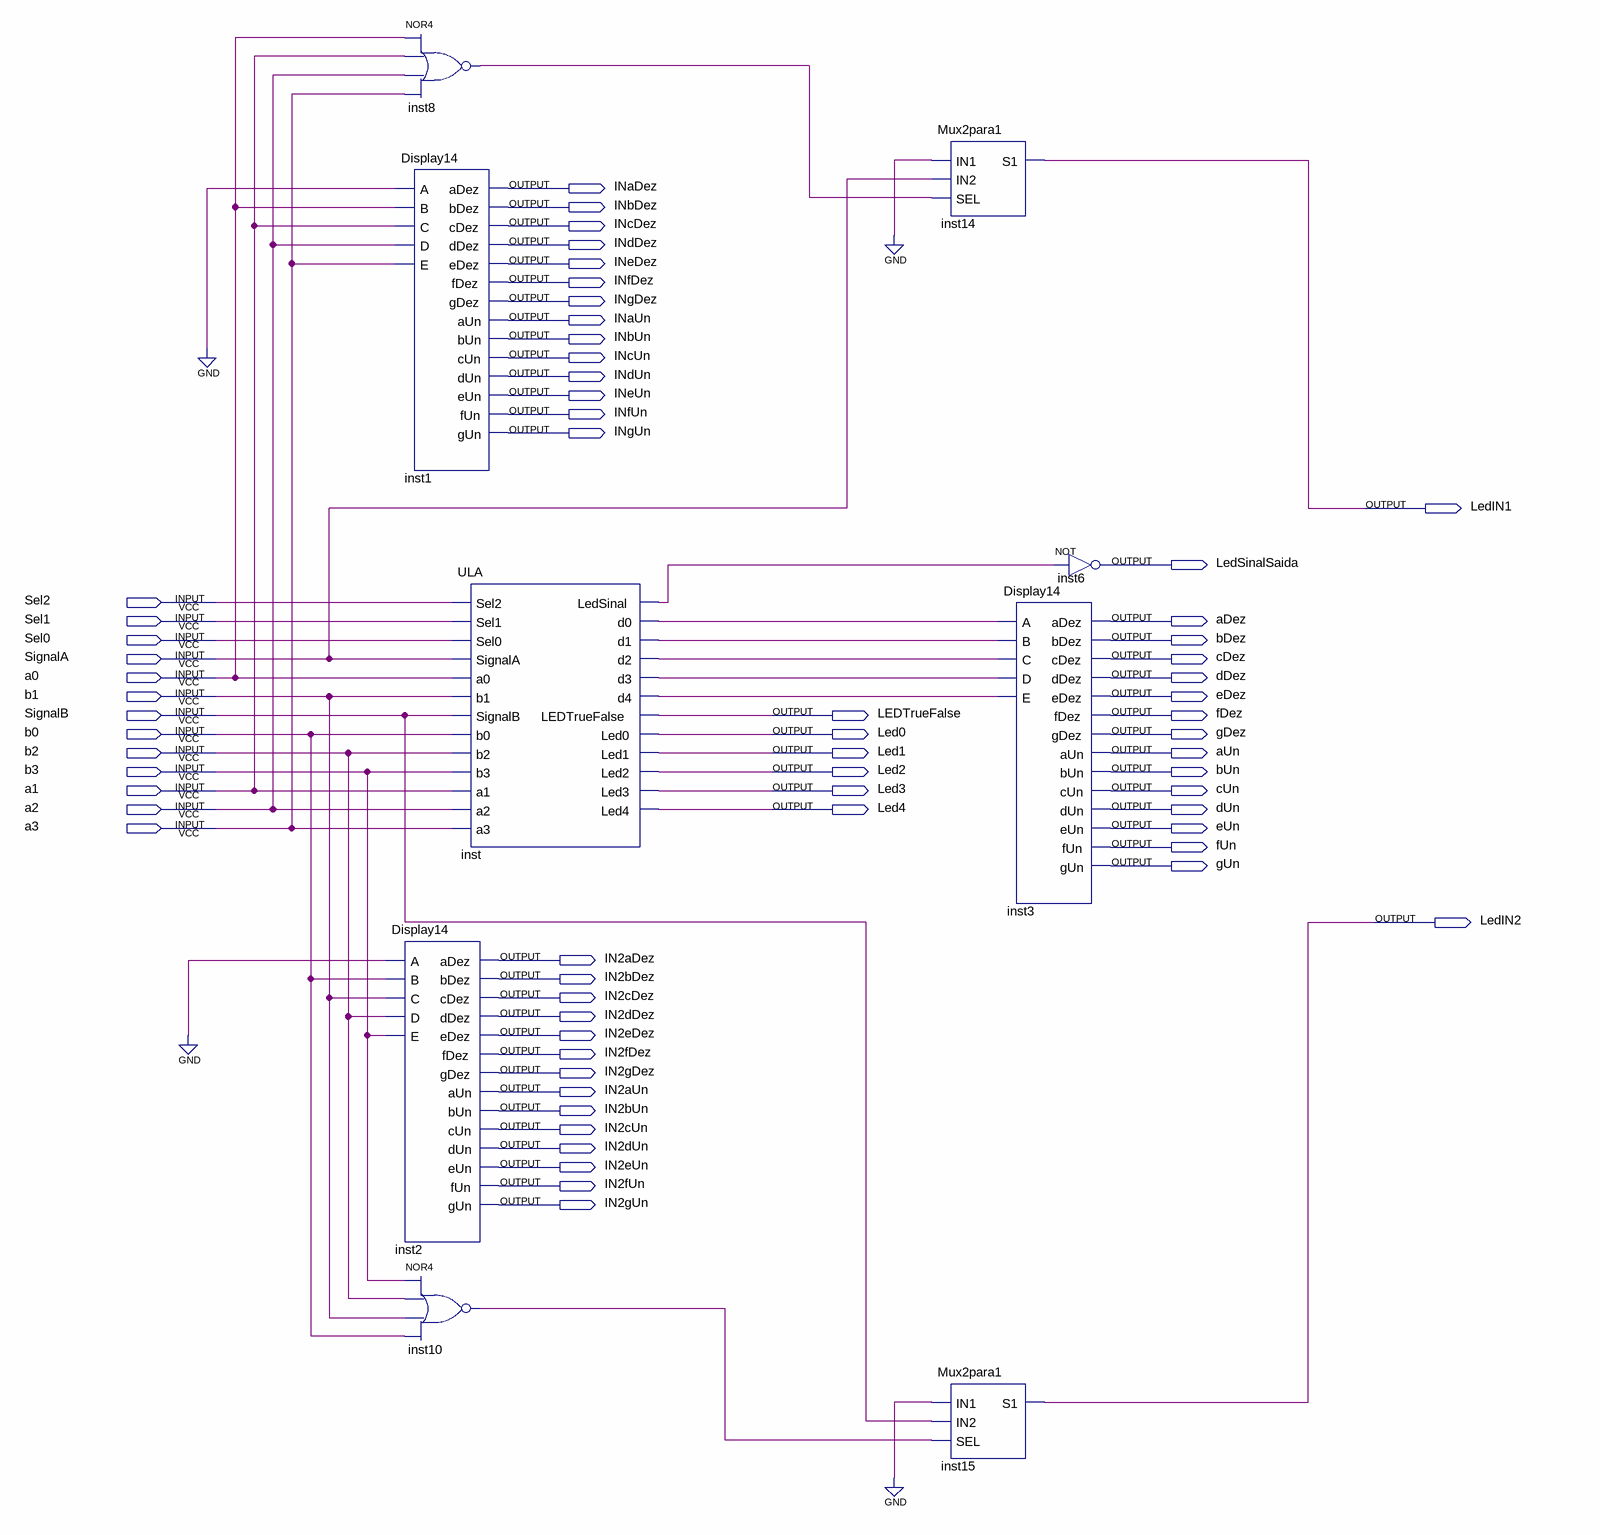
[diagram p0: schematic sheet]
// Quartus schematic FinalULAULA.bdf as structural Verilog: 9 symbols, 64 pins
module FinalULAULA (
  input  Sel2,
  input  Sel1,
  input  Sel0,
  input  SignalA,
  input  a0,
  input  b1,
  input  SignalB,
  input  b0,
  input  b2,
  input  b3,
  input  a1,
  input  a2,
  input  a3,
  output INaDez,
  output INbDez,
  output INcDez,
  output INdDez,
  output INeDez,
  output INfDez,
  output INgDez,
  output INaUn,
  output INbUn,
  output INcUn,
  output INdUn,
  output INeUn,
  output INfUn,
  output INgUn,
  output LedIN1,
  output LedSinalSaida,
  output aDez,
  output bDez,
  output cDez,
  output dDez,
  output eDez,
  output LEDTrueFalse,
  output fDez,
  output Led0,
  output gDez,
  output Led1,
  output aUn,
  output Led2,
  output bUn,
  output Led3,
  output cUn,
  output Led4,
  output dUn,
  output eUn,
  output fUn,
  output gUn,
  output LedIN2,
  output IN2aDez,
  output IN2bDez,
  output IN2cDez,
  output IN2dDez,
  output IN2eDez,
  output IN2fDez,
  output IN2gDez,
  output IN2aUn,
  output IN2bUn,
  output IN2cUn,
  output IN2dUn,
  output IN2eUn,
  output IN2fUn,
  output IN2gUn
);

  wire inst8_out, inst10_out, inst_d0, inst_d1, inst_d2, inst_d3, inst_d4, inst_ledsinal;

  nor inst8 (inst8_out, a0, a1, a2, a3);
  Display14 inst1 (
    .A(1'b0), .B(a0), .C(a1), .D(a2), .E(a3), .aDez(INaDez), .bDez(INbDez), .cDez(INcDez), .dDez(INdDez),
    .eDez(INeDez), .fDez(INfDez), .gDez(INgDez), .aUn(INaUn), .bUn(INbUn), .cUn(INcUn), .dUn(INdUn),
    .eUn(INeUn), .fUn(INfUn), .gUn(INgUn));
  Display14 inst2 (
    .A(1'b0), .B(b0), .C(b1), .D(b2), .E(b3), .aDez(IN2aDez), .bDez(IN2bDez), .cDez(IN2cDez), .dDez(IN2dDez),
    .eDez(IN2eDez), .fDez(IN2fDez), .gDez(IN2gDez), .aUn(IN2aUn), .bUn(IN2bUn), .cUn(IN2cUn), .dUn(IN2dUn),
    .eUn(IN2eUn), .fUn(IN2fUn), .gUn(IN2gUn));
  nor inst10 (inst10_out, b3, b2, b1, b0);
  ULA inst (
    .Sel2(Sel2), .Sel1(Sel1), .Sel0(Sel0), .SignalA(SignalA), .a0(a0), .b1(b1), .SignalB(SignalB), .b0(b0),
    .b2(b2), .b3(b3), .a1(a1), .a2(a2), .a3(a3), .LedSinal(inst_ledsinal), .d0(inst_d0), .d1(inst_d1),
    .d2(inst_d2), .d3(inst_d3), .d4(inst_d4), .LEDTrueFalse(LEDTrueFalse), .Led0(Led0), .Led1(Led1),
    .Led2(Led2), .Led3(Led3), .Led4(Led4));
  Mux2para1 inst14 (.IN1(1'b0), .IN2(SignalA), .SEL(inst8_out), .S1(LedIN1));
  Mux2para1 inst15 (.IN1(1'b0), .IN2(SignalB), .SEL(inst10_out), .S1(LedIN2));
  Display14 inst3 (
    .A(inst_d0), .B(inst_d1), .C(inst_d2), .D(inst_d3), .E(inst_d4), .aDez(aDez), .bDez(bDez), .cDez(cDez),
    .dDez(dDez), .eDez(eDez), .fDez(fDez), .gDez(gDez), .aUn(aUn), .bUn(bUn), .cUn(cUn), .dUn(dUn),
    .eUn(eUn), .fUn(fUn), .gUn(gUn));
  not inst6 (LedSinalSaida, inst_ledsinal);
endmodule
